# EAGLE design freezer_alarm-small (EAGLE 9.3.2)
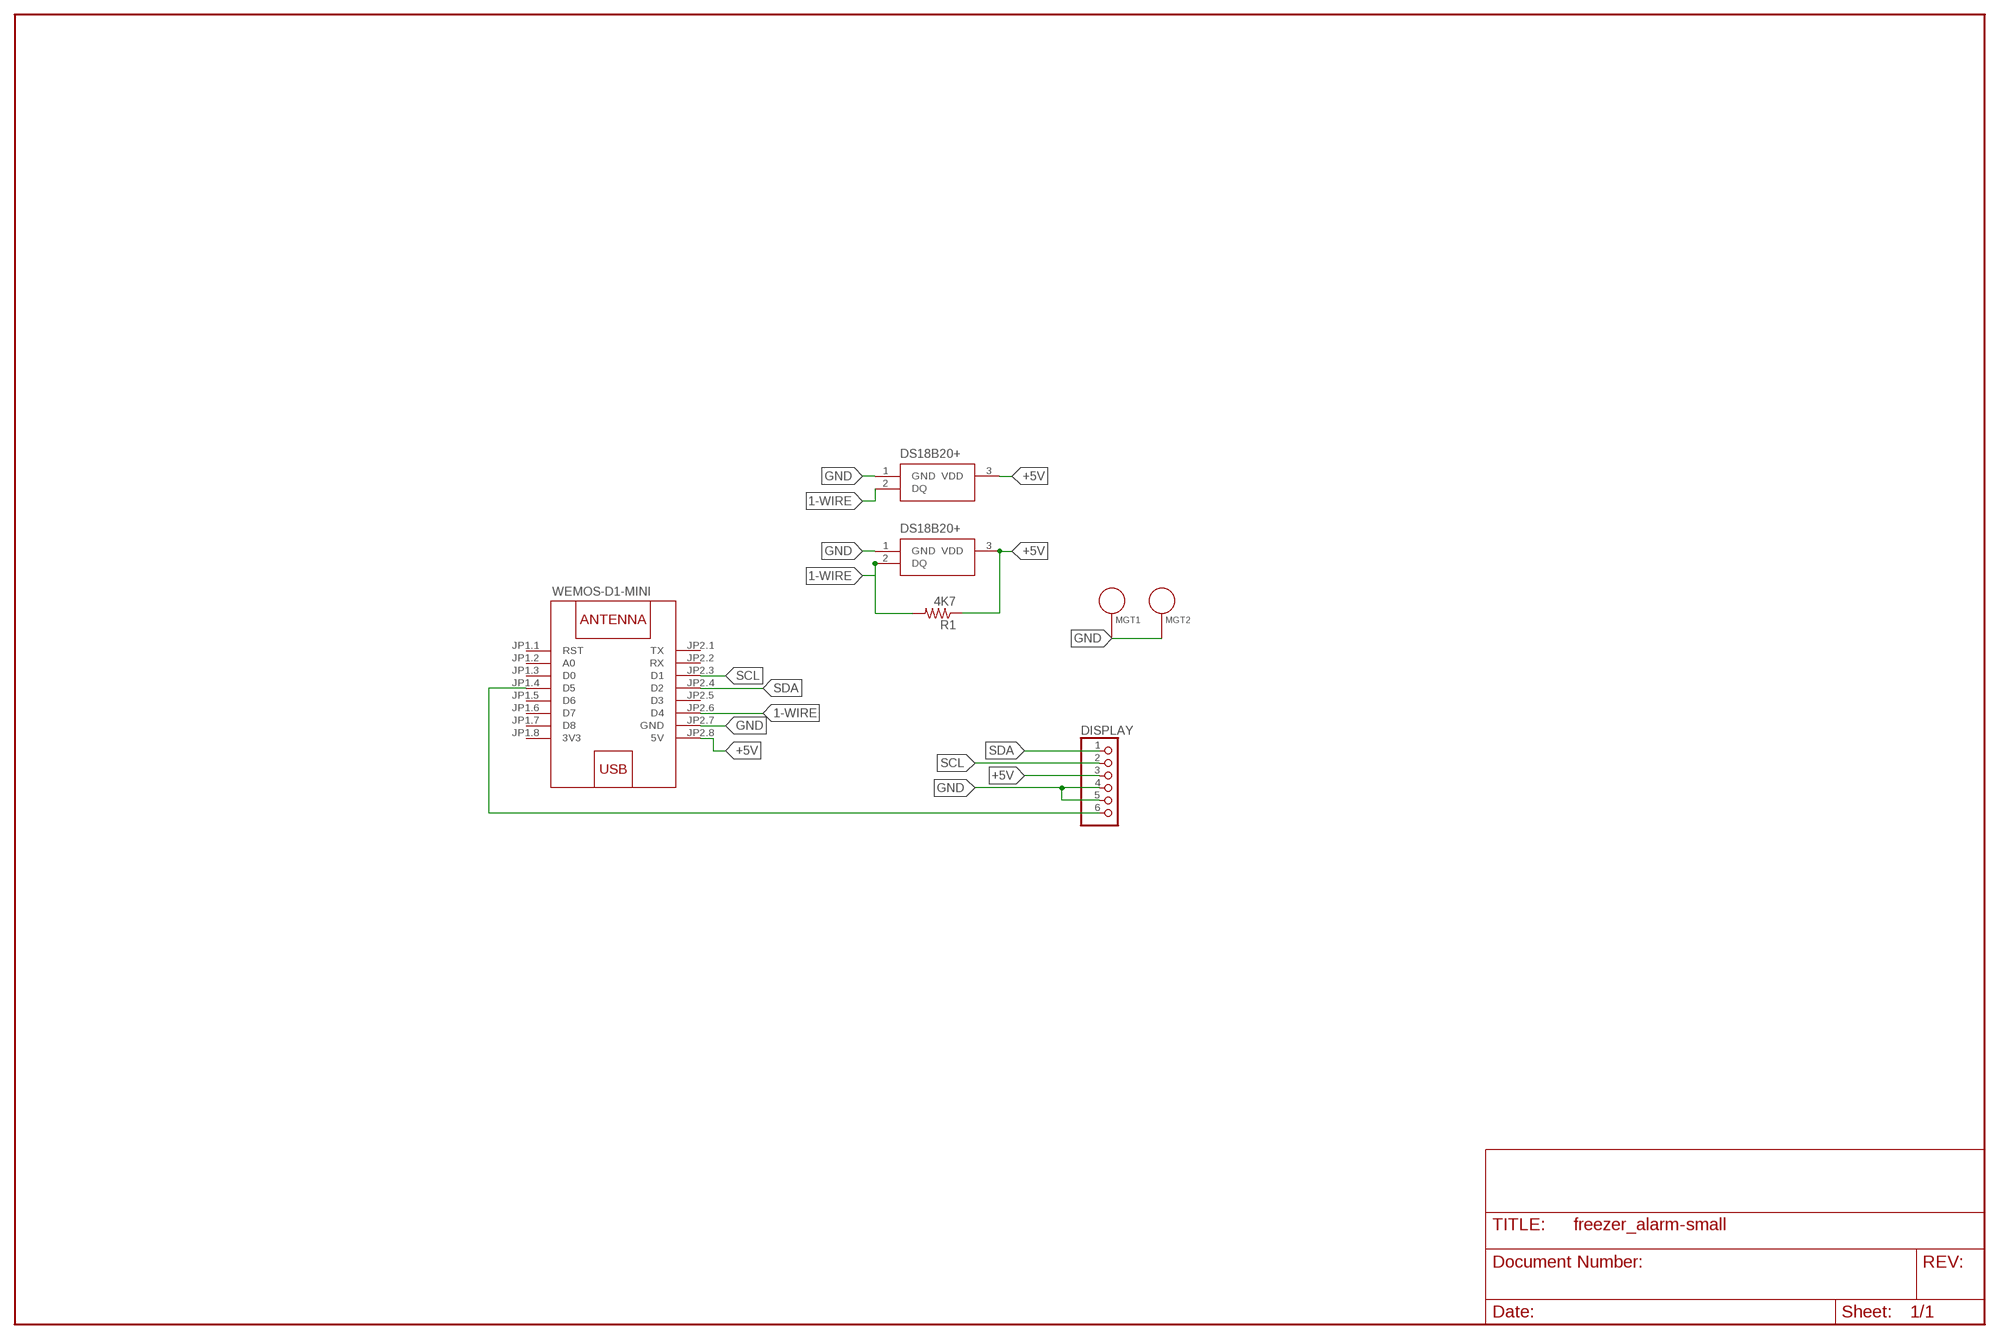
[diagram p0: schematic, sheet 1]

## Parts
DISPLAY  PINHD-1X6  [1X06]
IC1  DS18B20+  [TO-92]
IC2  DS18B20+  [TO-92]
MGT1  BEAGLEBONEBLACK_MOUNTING_HOLE  [BEAGLEBONEBLACK_MOUNTING_HOLE]
MGT2  BEAGLEBONEBLACK_MOUNTING_HOLE  [BEAGLEBONEBLACK_MOUNTING_HOLE]
R1  4K7  R-US_0207/10  [0207/10]
W1  WEMOS-D1-MINI  [WEMOS-D1-MINI]

## Nets
1-WIRE: IC1.2(DQ) IC2.2(DQ) R1.2 W1.JP2.6(D4)
+5V: DISPLAY.3 IC1.3(VDD) IC2.3(VDD) R1.1 W1.JP2.8(5V)
GND: DISPLAY.4 DISPLAY.5 IC1.1(GND) IC2.1(GND) W1.JP2.7(GND)
N$1: MGT1.P$1 MGT2.P$1
N$2: DISPLAY.6 W1.JP1.4(D5)
SCL: DISPLAY.2 W1.JP2.3(D1)
SDA: DISPLAY.1 W1.JP2.4(D2)
Unconnected: W1.JP1.1(RST) W1.JP1.2(A0) W1.JP1.3(D0) W1.JP1.5(D6) W1.JP1.6(D7) W1.JP1.7(D8) W1.JP2.1(TX) W1.JP2.2(RX) W1.JP2.5(D3)

## Power pins joined to a net without a drawn wire
3V3: W1.JP1.8(3V3)

## Library data of the parts
DISPLAY = pinhead:PINHD-1X6: PIN HEADER
IC1 IC2 = SamacSys_Parts:DS18B20+: DS18B20 prog thermometer 1-Wire, TO92 Source: Datasheet <https://componentsearchengine.com/Datasheets/1/DS18B20 .pdf>; DESCRIPTION: DS18B20 prog thermometer 1-Wire, TO92; HEIGHT: mm; MANUFACTURER_NAME: Maxim Integrated; MANUFACTURER_PART_NUMBER: DS18B20+; MOUSER_PART_NUMBER: 700-DS18B20+; MOUSER_PRICE-STOCK: https://www.mouser.com/Search/Refine.aspx?Keyword=700-DS18B20%2B
MGT1 MGT2 = BeagleBone_Black_Wireless:BEAGLEBONEBLACK_MOUNTING_HOLE: Chassis Mounting Hole w/GND connection ability
R1 = adafruit:R-US_: RESISTOR, American symbol
W1 = diy-modules:WEMOS-D1-MINI: WEMOS D1 mini: Mini Wi-Fi Board based on ESP-8266 device More details can be found here: https://www.wemos.cc/product/d1-mini.html Click here to find device on ebay.com <http://www.ebay.com/sch/wemos+d1+mini+nodemcu>

## Board
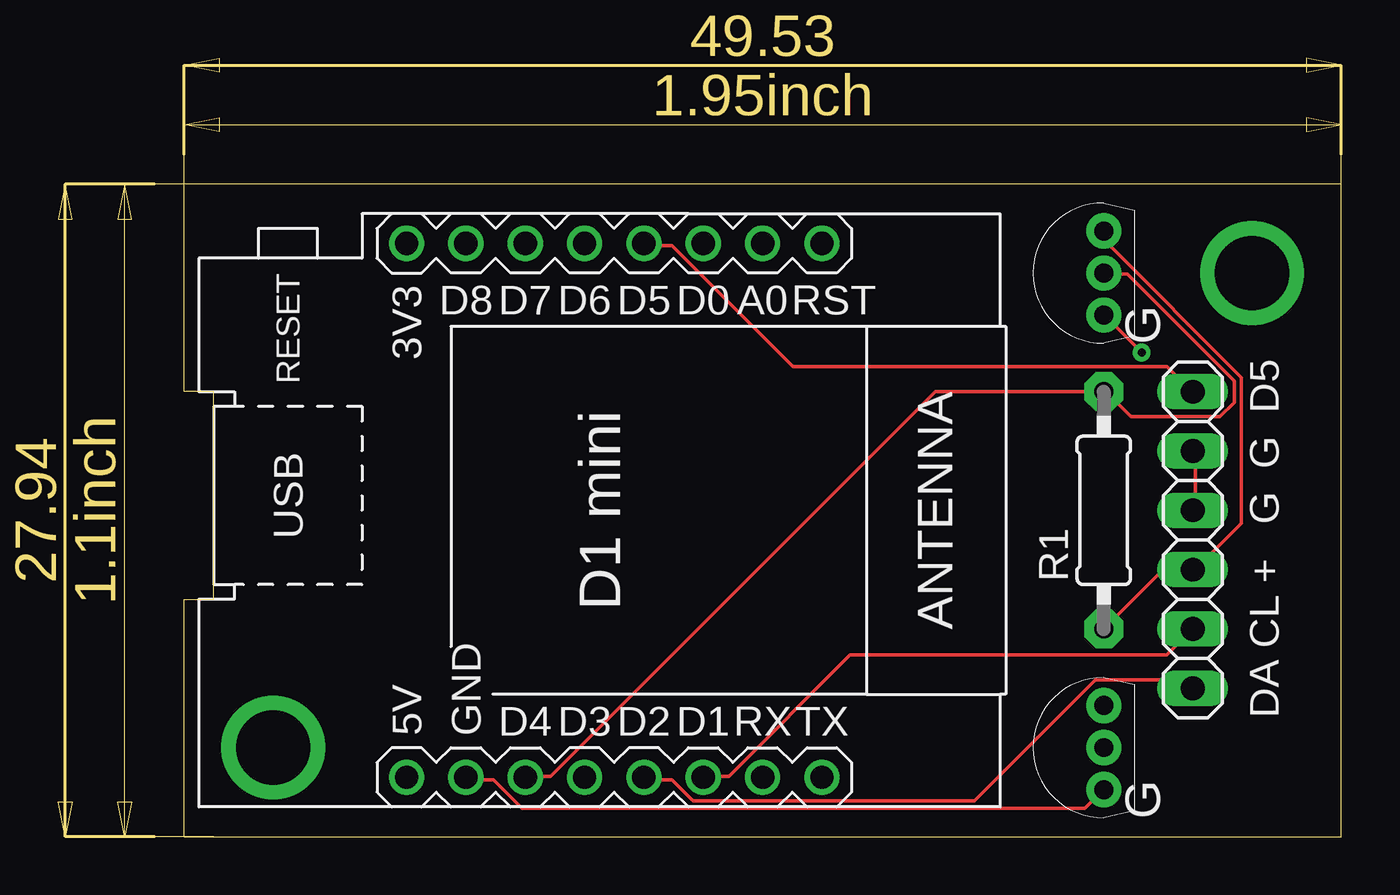
[diagram p1: board, top side]
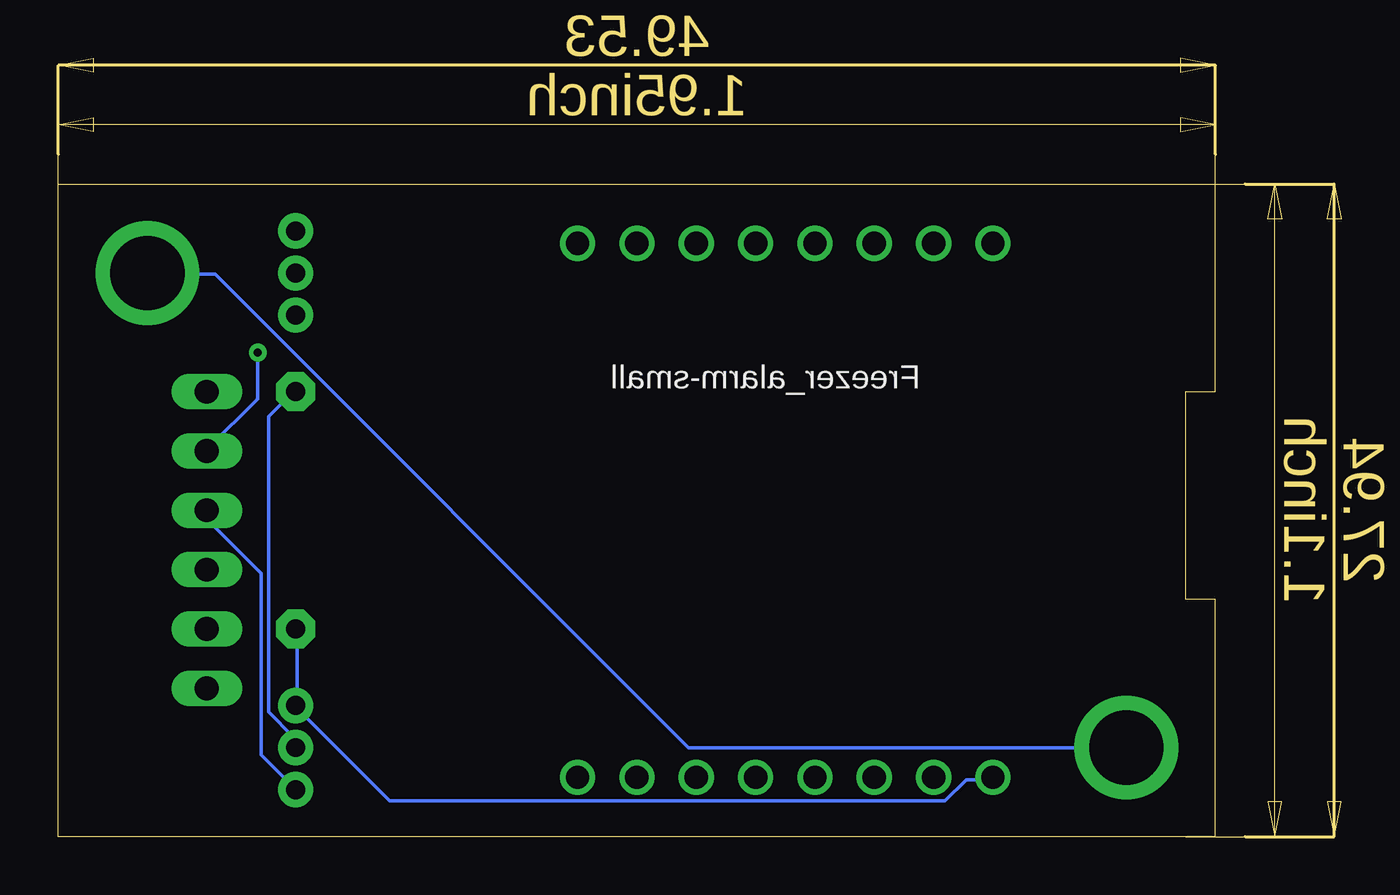
[diagram p2: board, bottom side, seen from below]

Size 49.53 x 27.94 mm. Coordinates in mm from the lower left corner, seen from the top.
Outline: 0,0 49.53,0 49.53,27.94 0,27.94 0,19.05 1.27,19.05 1.27,10.16 0,10.16 0,0
Copper layers (1*16): Top 0.035mm / dielectric 1.5mm / Bottom 0.035mm
Design rules "default": minimum track width 6mil, minimum drill 0.35mm, track to track 6mil, track to pad 6mil, pad to pad 6mil, via to via 6mil, smd to smd 6mil, copper to edge 40mil, drill to drill 6mil, minimum pad ring 10mil, minimum via ring 8mil, stop-mask expansion 4mil, vias tented up to drill 0mil, thermal gap 10mil

### Footprints (pad centres in the part's own frame; a part is rotated, then mirrored left to right if it is on the bottom)
1X06 = drill 1.016 long: 1 -6.35,0; 2 -3.81,0; 3 -1.27,0; 4 1.27,0; 5 3.81,0; 6 6.35,0
TO-92 = drill 0.81 pad 1.51: 1 0,-1.8; 2 0,0; 3 0,1.8
BEAGLEBONEBLACK_MOUNTING_HOLE = drill 3.175 pad 4.445: P$1 0,0
0207/10 = drill 0.813 pad 1.676 octagon: 1 -5.08,0; 2 5.08,0
WEMOS-D1-MINI = drill 1: JP1.1 -11.43,9.525; JP1.2 -11.43,6.985; JP1.3 -11.43,4.445; JP1.4 -11.43,1.905; JP1.5 -11.43,-0.635; JP1.6 -11.43,-3.175; JP1.7 -11.43,-5.715; JP1.8 -11.43,-8.255; JP2.1 11.43,9.525; JP2.2 11.43,6.985; JP2.3 11.43,4.445; JP2.4 11.43,1.905; JP2.5 11.43,-0.635; JP2.6 11.43,-3.175; JP2.7 11.43,-5.715; JP2.8 11.43,-8.255

### Placement (x,y rotation side)
DISPLAY  43.18,12.7 90 top
IC1  39.37,3.81 0 top
IC2  39.37,24.13 0 top
MGT1  3.81,3.81 0 top
MGT2  45.72,24.13 0 top
R1  39.37,13.97 90 top
W1  17.78,13.97 270 top

### Tracks (layer width: path | path; a pad name or v marks a point on that pad's centre or on a via)
1-WIRE
  Top 0.152: W1.JP2.6 14.63,2.59 15.7,2.59 32.16,19.05 R1.2 39.47,19.05 40.54,17.98 44.35,17.98 44.96,18.59 44.96,19.51 40.39,24.08 39.47,24.08 IC2.2
  Bottom 0.152: IC1.2 39.47,3.81 39.47,4.27 40.54,5.33 40.54,17.98 39.47,19.05 R1.2
+5V
  Top 0.152: IC2.3 39.47,25.91 39.47,25.45 45.26,19.66 45.26,13.41 43.28,11.43 DISPLAY.3 41.91,11.43 R1.1
  Bottom 0.152: W1.JP2.8 9.6,2.44 10.67,2.44 11.58,1.52 35.36,1.52 39.32,5.49 IC1.3 39.32,5.64 39.32,8.84 R1.1
GND  (via drill 0.35)
  Top 0.152: v41,20.73 39.47,22.25 IC2.1 | DISPLAY.4 43.28,14.02 43.28,16.46 DISPLAY.5 | W1.JP2.7 12.19,2.44 13.26,2.44 14.48,1.22 38.56,1.22 39.32,1.98 IC1.1
  Bottom 0.152: v41,20.73 41,18.75 43.13,16.61 DISPLAY.5 | DISPLAY.4 43.13,13.87 43.13,13.56 40.84,11.28 40.84,3.5 39.47,2.13 IC1.1
N$1
  Bottom 0.152: MGT1.P$1 22.55,3.81 42.82,24.08 45.72,24.08 MGT2.P$1
N$2
  Top 0.152: W1.JP1.4 19.81,25.3 20.88,25.3 26.06,20.12 42.06,20.12 43.13,19.05 DISPLAY.6
SCL
  Top 0.152: DISPLAY.2 42.06,7.77 28.5,7.77 23.32,2.59 22.25,2.59 W1.JP2.3
SDA
  Top 0.152: DISPLAY.1 42.82,6.71 39.01,6.71 33.83,1.52 21.79,1.52 20.88,2.44 19.81,2.44 W1.JP2.4

### Text on the board
tNames: G | DA CL + G G D5 | G
bNames: Freezer_alarm-small